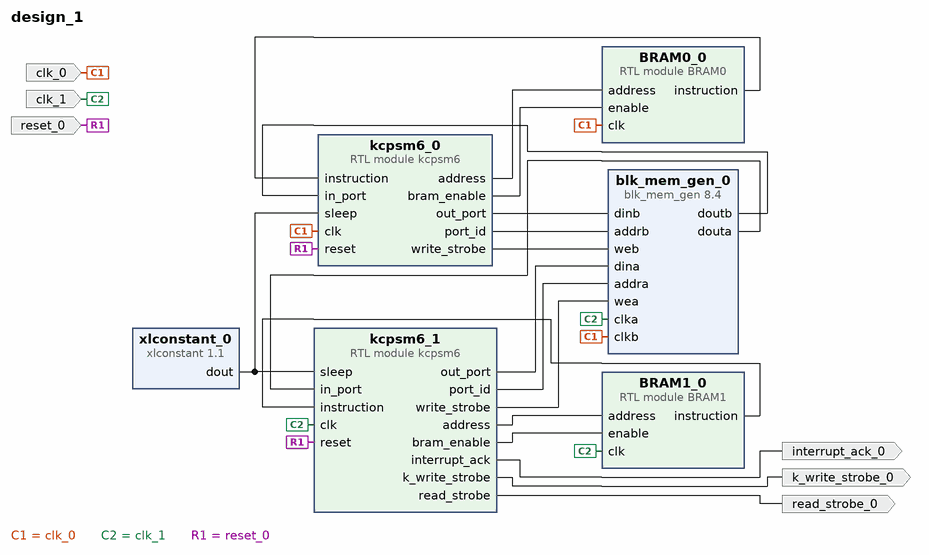
[diagram p0: block diagram of the top level]
# Vivado block design design_1, xc7k70tfbv676-1, Vivado 2022.2
create_bd_design design_1

create_bd_port -dir I -type clk clk_0
create_bd_port -dir I -type rst reset_0
create_bd_port -dir I -type clk clk_1
create_bd_port -dir O interrupt_ack_0
create_bd_port -dir O k_write_strobe_0
create_bd_port -dir O read_strobe_0

create_bd_cell -type module -reference kcpsm6 kcpsm6_1
create_bd_cell -type ip -vlnv xilinx.com:ip:blk_mem_gen:8.4 blk_mem_gen_0
set_property -dict [list \
  CONFIG.Assume_Synchronous_Clk false \
  CONFIG.Coe_File ../../../../../../../initial_ram.coe \
  CONFIG.Enable_A Always_Enabled \
  CONFIG.Enable_B Always_Enabled \
  CONFIG.Load_Init_File true \
  CONFIG.Memory_Type True_Dual_Port_RAM \
  CONFIG.Register_PortA_Output_of_Memory_Primitives false \
  CONFIG.Register_PortB_Output_of_Memory_Primitives false \
  CONFIG.Write_Depth_A 256 \
  CONFIG.Write_Width_A 8 \
  CONFIG.use_bram_block Stand_Alone \
] [get_bd_cells blk_mem_gen_0]
create_bd_cell -type ip -vlnv xilinx.com:ip:xlconstant:1.1 xlconstant_0
set_property -dict {CONFIG.CONST_VAL 0} [get_bd_cells xlconstant_0]
create_bd_cell -type module -reference kcpsm6 kcpsm6_0
create_bd_cell -type module -reference BRAM0 BRAM0_0
create_bd_cell -type module -reference BRAM1 BRAM1_0

# ---- connections ----

connect_bd_net [get_bd_pins BRAM0_0/instruction] [get_bd_pins kcpsm6_0/instruction]
connect_bd_net [get_bd_pins BRAM1_0/instruction] [get_bd_pins kcpsm6_1/instruction]
connect_bd_net [get_bd_pins blk_mem_gen_0/douta] [get_bd_pins kcpsm6_1/in_port]
connect_bd_net [get_bd_pins blk_mem_gen_0/doutb] [get_bd_pins kcpsm6_0/in_port]
connect_bd_net -net clk_0_1 [get_bd_ports clk_0] [get_bd_pins blk_mem_gen_0/clkb] [get_bd_pins kcpsm6_0/clk] [get_bd_pins BRAM0_0/clk]
connect_bd_net -net clk_1_1 [get_bd_ports clk_1] [get_bd_pins kcpsm6_1/clk] [get_bd_pins blk_mem_gen_0/clka] [get_bd_pins BRAM1_0/clk]
connect_bd_net [get_bd_pins kcpsm6_0/address] [get_bd_pins BRAM0_0/address]
connect_bd_net [get_bd_pins kcpsm6_0/bram_enable] [get_bd_pins BRAM0_0/enable]
connect_bd_net [get_bd_pins kcpsm6_0/out_port] [get_bd_pins blk_mem_gen_0/dinb]
connect_bd_net [get_bd_pins kcpsm6_0/port_id] [get_bd_pins blk_mem_gen_0/addrb]
connect_bd_net [get_bd_pins kcpsm6_0/write_strobe] [get_bd_pins blk_mem_gen_0/web]
connect_bd_net [get_bd_pins kcpsm6_1/address] [get_bd_pins BRAM1_0/address]
connect_bd_net [get_bd_pins kcpsm6_1/bram_enable] [get_bd_pins BRAM1_0/enable]
connect_bd_net [get_bd_pins kcpsm6_1/interrupt_ack] [get_bd_ports interrupt_ack_0]
connect_bd_net [get_bd_pins kcpsm6_1/k_write_strobe] [get_bd_ports k_write_strobe_0]
connect_bd_net [get_bd_pins kcpsm6_1/out_port] [get_bd_pins blk_mem_gen_0/dina]
connect_bd_net [get_bd_pins kcpsm6_1/port_id] [get_bd_pins blk_mem_gen_0/addra]
connect_bd_net [get_bd_pins kcpsm6_1/read_strobe] [get_bd_ports read_strobe_0]
connect_bd_net [get_bd_pins kcpsm6_1/write_strobe] [get_bd_pins blk_mem_gen_0/wea]
connect_bd_net -net reset_0_1 [get_bd_ports reset_0] [get_bd_pins kcpsm6_1/reset] [get_bd_pins kcpsm6_0/reset]
connect_bd_net [get_bd_pins xlconstant_0/dout] [get_bd_pins kcpsm6_1/sleep] [get_bd_pins kcpsm6_0/sleep]

validate_bd_design
save_bd_design
